# Altium schematic sheet Power.SchDoc
size A4
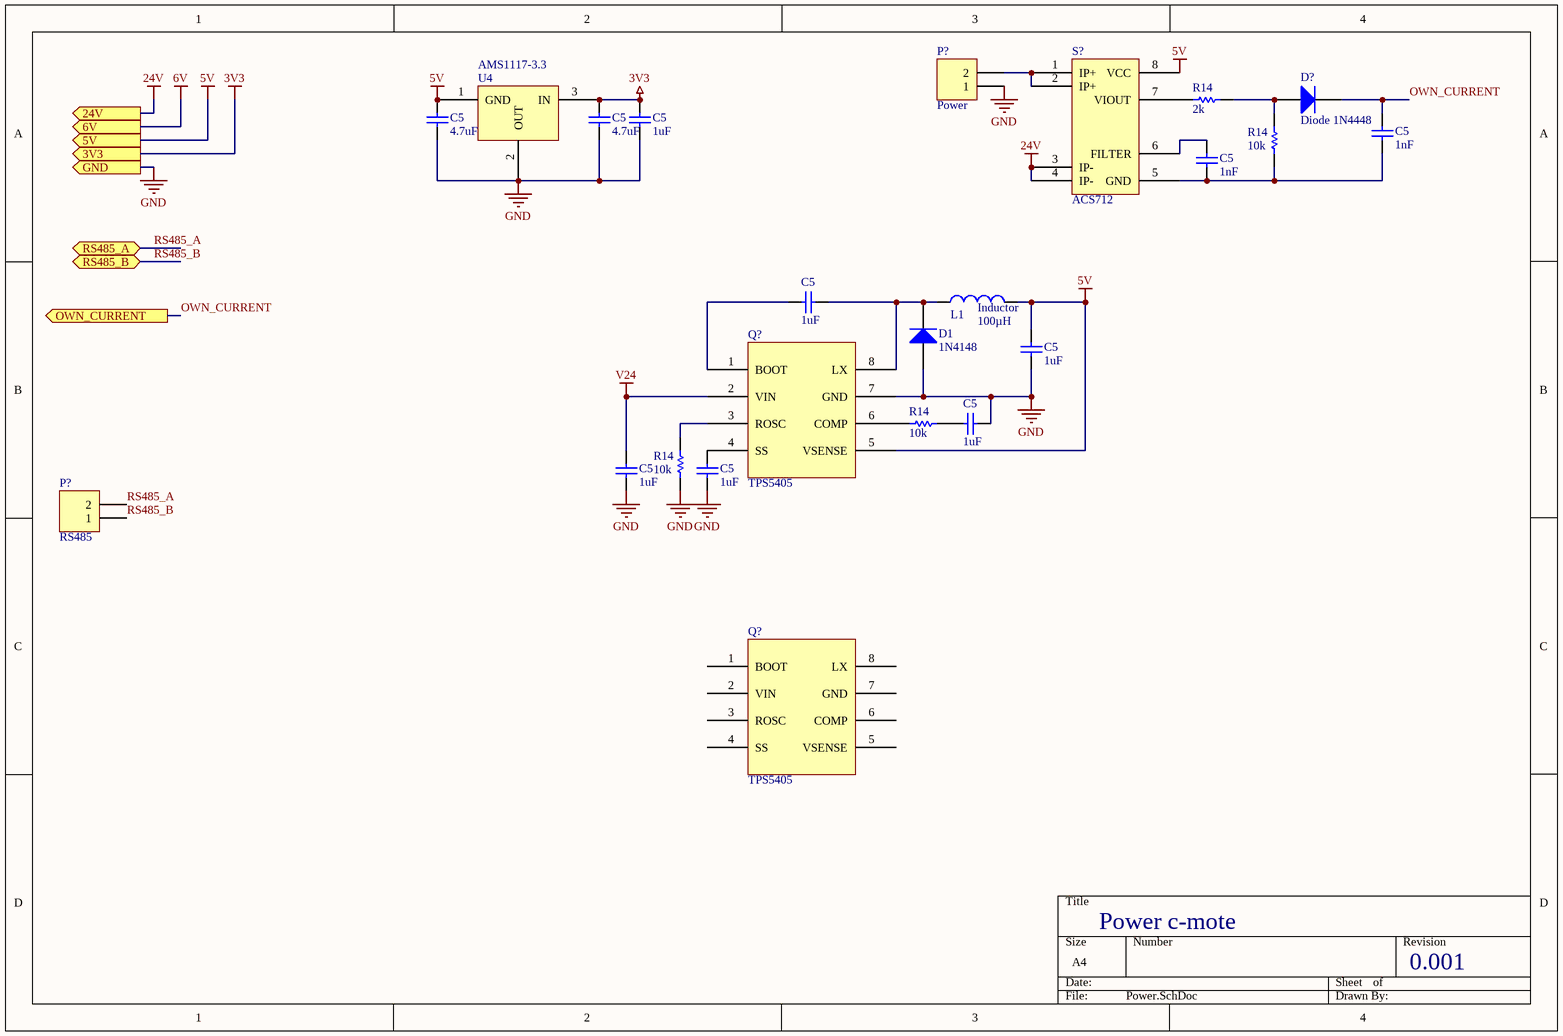
[diagram p0: Power.SchDoc]

## Parts
(Parts that share a designator on the sheet are numbered #1, #2 ... from top to bottom, then left to right.)
C5#1  value 4.7uF  [CAPC0805(2012)145_M]  (hidden comment: CAP 1uF 10V 0805(2012))
C5#2  value 4.7uF  [CAPC0805(2012)145_M]  (hidden comment: CAP 1uF 10V 0805(2012))
C5#3  value 1uF  [CAPC0805(2012)145_M]  (hidden comment: CAP 1uF 10V 0805(2012))
C5#4  value 1nF  [CAPC0805(2012)145_M]  (hidden comment: CAP 1uF 10V 0805(2012))
C5#5  value 1nF  [CAPC0805(2012)145_M]  (hidden comment: CAP 1uF 10V 0805(2012))
C5#6  value 1uF  [CAPC0805(2012)145_M]  (hidden comment: CAP 1uF 10V 0805(2012))
C5#7  value 1uF  [CAPC0805(2012)145_M]  (hidden comment: CAP 1uF 10V 0805(2012))
C5#8  value 1uF  [CAPC0805(2012)145_M]  (hidden comment: CAP 1uF 10V 0805(2012))
C5#9  value 1uF  [CAPC0805(2012)145_M]  (hidden comment: CAP 1uF 10V 0805(2012))
C5#10  value 1uF  [CAPC0805(2012)145_M]  (hidden comment: CAP 1uF 10V 0805(2012))
D1  1N4148  [SOD-323F]
D?  Diode 1N4448  [DO-35]
L1  Inductor  value 100µH  [INDC3216]
P?#1  Power  [HDR1X2]
P?#2  RS485  [HDR1X2]
Q?#1  TPS5405  [TPS5405 - duplicate]
Q?#2  TPS5405  [TPS5405 - duplicate]
R14#1  2k  [6-0805]
R14#2  10k  [6-0805]
R14#3  10k  [6-0805]
R14#4  10k  [6-0805]
S?  ACS712  [SOP8]
U4  AMS1117-3.3  [SOT223]

## Ports
3V3 (out), 5V (out), 6V (out), 24V (out), GND (out), OWN_CURRENT (out), RS485_A (bidir), RS485_B (bidir)

## Nets
3V3: C5#2.2 C5#3.2 U4.3(IN) ; port 3V3
5V: C5#1.2 C5#7.1 L1.2 Q?#1.5(VSENSE) S?.8(VCC) U4.1(GND) ; port 5V
6V: port 6V
24V: S?.3(IP-) S?.4(IP-) ; port 24V
GND: C5#1.1 C5#2.1 C5#3.1 C5#7.2 C5#8.1 C5#9.2 C5#10.2 D1.1(A) P?#1.1 Q?#1.7(GND) R14#4.2 U4.2(OUT) ; port GND
V24: C5#9.1 Q?#1.2(VIN)
OWN_CURRENT: C5#4.2 D?.2(K) ; port OWN_CURRENT
RS485_A: P?#2.2 ; port RS485_A
RS485_B: P?#2.1 ; port RS485_B
NetC5#4_1: C5#4.1 C5#5.1 R14#2.2 S?.5(GND)
NetC5#5_2: C5#5.2 S?.6(FILTER)
NetC5#6_1: C5#6.1 D1.2(K) L1.1 Q?#1.8(LX)
NetC5#6_2: C5#6.2 Q?#1.1(BOOT)
NetC5#8_2: C5#8.2 R14#3.2
NetC5#10_1: C5#10.1 Q?#1.4(SS)
NetD?_1: D?.1(A) R14#1.2 R14#2.1
NetP?#1_2: P?#1.2 S?.1(IP+) S?.2(IP+)
NetQ?#1_3: Q?#1.3(ROSC) R14#4.1
NetQ?#1_6: Q?#1.6(COMP) R14#3.1
NetR14#1_1: R14#1.1 S?.7(VIOUT)

Not connected (* = marked no-connect by the designer): Q?#2 1(BOOT) 2(VIN) 3(ROSC) 4(SS) 5(VSENSE) 6(COMP) 7(GND) 8(LX)

## Notes on the sheet
- Power c-mote
- 0.001

## Library data of the parts
C5#1-C5#10 = CMP-1036-04740-1: CAP 1uF 10V ±20% 0805 (2012 Metric) Thickness 1.45mm SMD; Case-Metric: 2012; Case-EIA: 0805; Technology: SMT; Rated Voltage: 10 V; Tolerance: ±20%; Max Thickness: 1.45 mm
D1 = 1N4148: High Conductance Fast Diode; Published: 8-Jun-2000; LatestRevisionDate: 17-Jul-2002; LatestRevisionNote: Re-released for DXP Platform.; DatasheetDocument: 1997; PackageReference: DO-35; Publisher: Altium Limited; Code_JEDEC: DO-204-AH; ComponentLink1Description: Manufacturer Link; ComponentLink1URL: http://www.fairchildsemi.com/; ComponentLink2Description: Datasheet; ComponentLink2URL: http://www.fairchildsemi.com/ds/1N%2F1N4148.pdf
D? = Diode 1N4448: High Conductance Fast Diode; Published: 8-Jun-2000; LatestRevisionDate: 17-Jul-2002; LatestRevisionNote: Re-released for DXP Platform.; DatasheetVersion: 1997; PackageReference: DO-35; Publisher: Altium Limited; PackageDescription: Diode, Axial; Body 3.8 x 1.9 mm (LxDia. max), Lead Dia. 0.53 mm (max); Code_JEDEC: DO-204-AH; ComponentLink1Description: Manufacturer Link; ComponentLink1URL: http://www.fairchildsemi.com/; ComponentLink2Description: Datasheet; ComponentLink2URL: http://www.fairchildsemi.com/ds/1N%2F1N4448.pdf
L1 = Inductor: Code_IEC: 1005; Published: 8-Jun-2000; LatestRevisionDate: 29-May-2009; LatestRevisionNote: IPC-7351 Footprint Added.; PackageReference: 0402-A; Publisher: Altium Limited; PackageDescription: Chip Inductor; Code_JEITA: 0402
P?#1 P?#2 = Header 2: Header, 2-Pin; LatestRevisionDate: 17-Jul-2002; LatestRevisionNote: Re-released for DXP Platform.; Publisher: Altium Limited
Q?#1 Q?#2 = TPS5405: Step Down Regulator
R14#1-R14#4 = ERJ6RB: Precision Thick Film Chip Resistor, 10 Ohm to 1M Ohm Range, 1% and 0.5% Tolerance, 0805 Size, 0.1 W; Published: 17-Dec-2003; LatestRevisionDate: 19-Mar-2004; LatestRevisionNote: Silkscreen size reduced.; PackageDocument: Mar-2003; PackageReference: 6-0805; Publisher: Altium Limited; Code_IPC: 2012 [0805]; ComponentLink1Description: Manufacturer Link; ComponentLink1URL: http://www.panasonic.com/industrial/components/resistive_products.htm; ComponentLink2Description: Datasheet; ComponentLink2URL: http://www.panasonic.com/industrial/components/pdf/AOA0000CE2.pdf
S? = ACS712: Linear Current Sensor
U4 = AMS1117